# EAGLE design PCB_OnOnfre_SINGLE_rev1 (EAGLE 9.1.3)
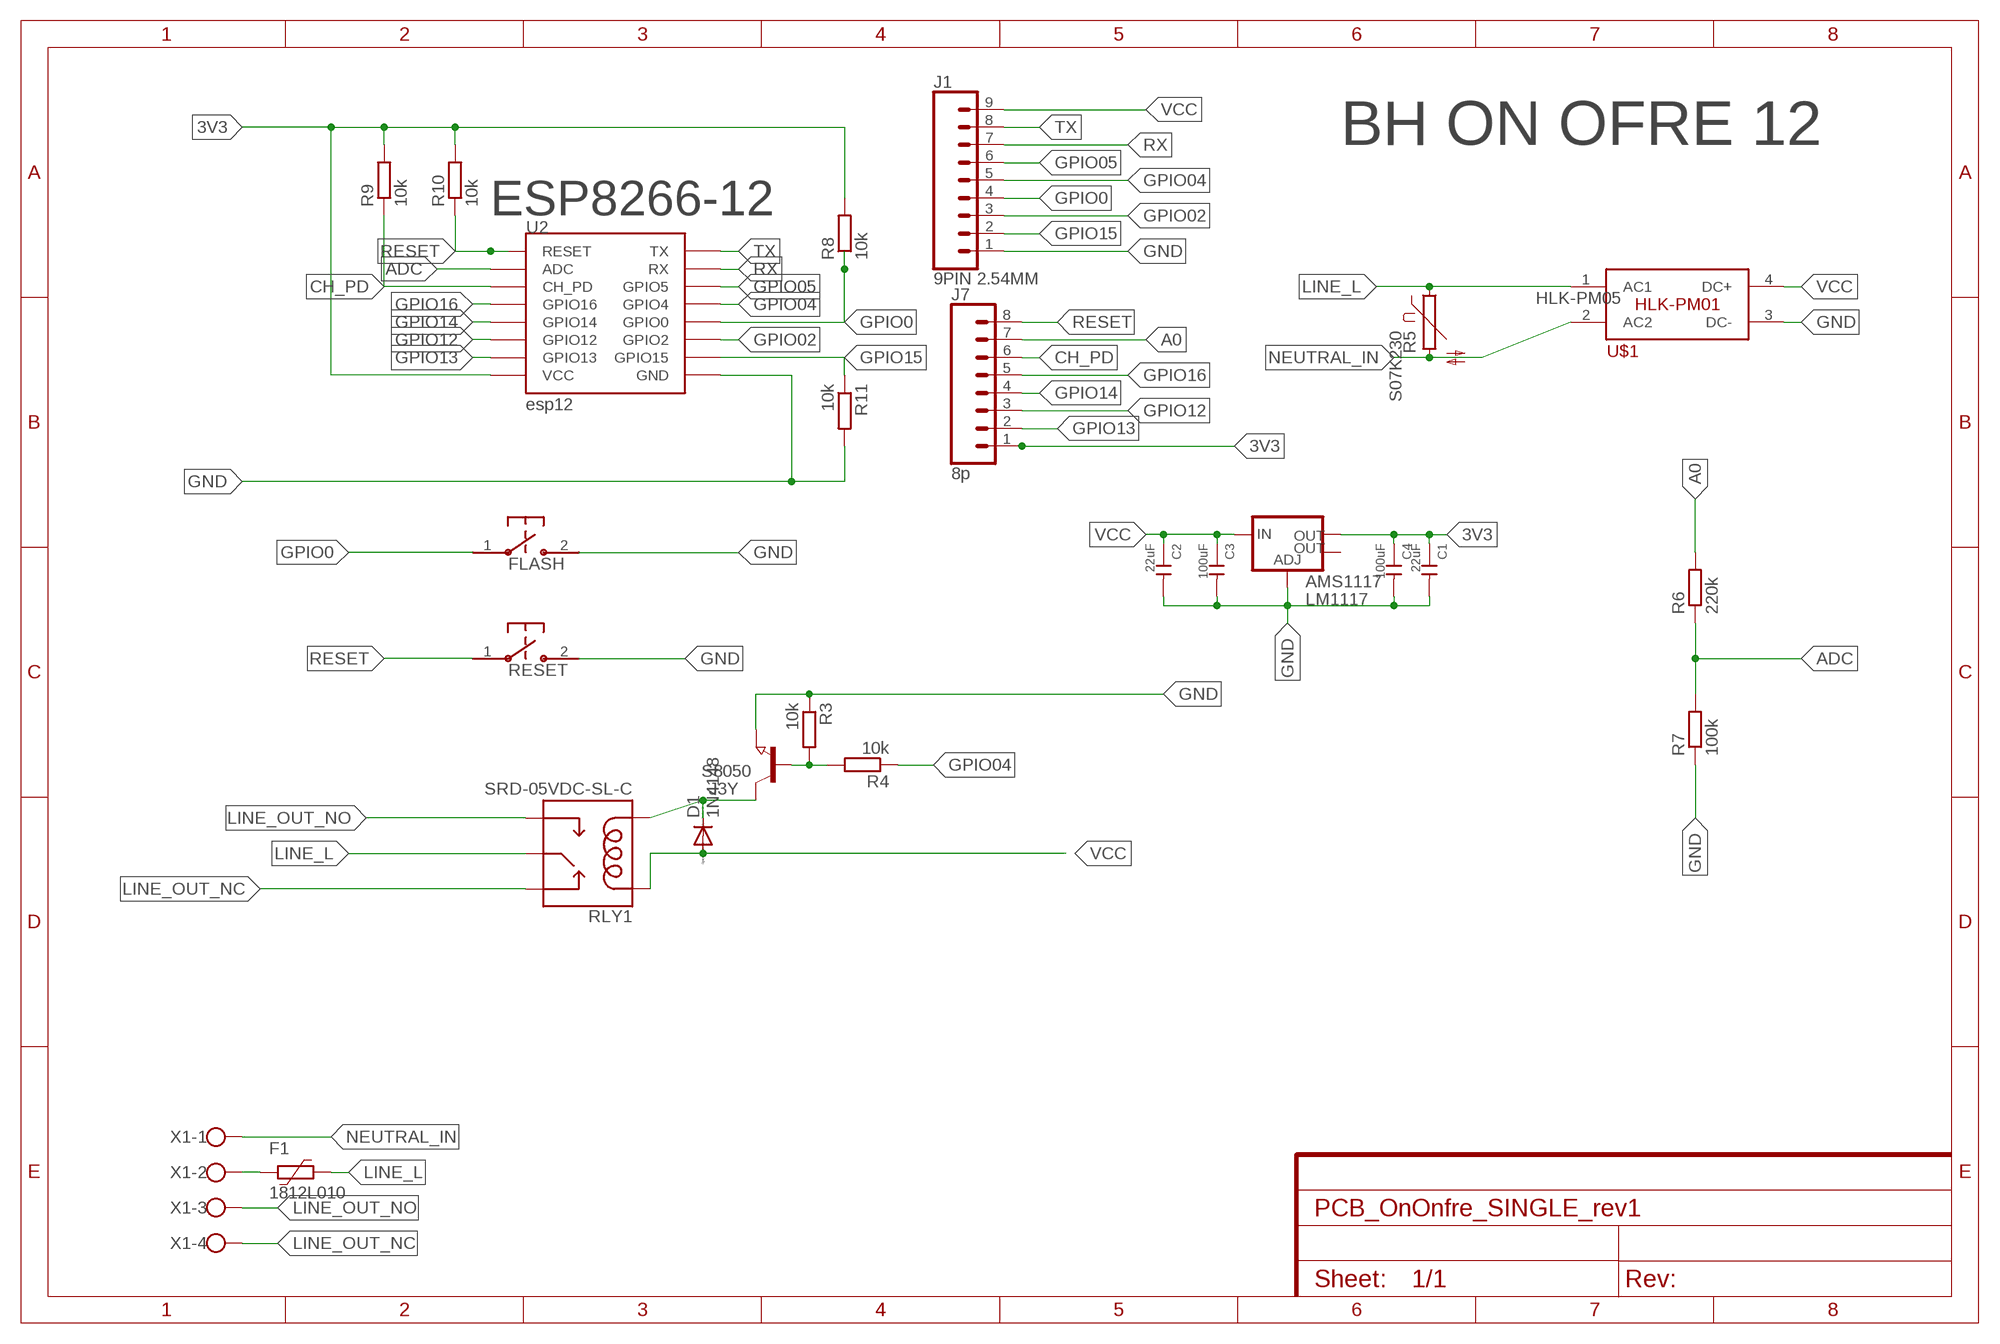
[diagram p0: schematic, sheet 1]

## Parts
AMS1117  LM1117  V_REG_LM1117SOT223  [SOT223]
C1  22uF  CERAMIC-1NF-1KV-10%-X7R(1206)  [C1206]
C2  22uF  CERAMIC-1NF-1KV-10%-X7R(1206)  [C1206]
C3  100uF  CERAMIC-1NF-1KV-10%-X7R(1206)  [C1206]
C4  100uF  CERAMIC-1NF-1KV-10%-X7R(1206)  [C1206]
D1  1N4148  DIODE-SOD80C  [SOD80C]
F1  1812L010  [1812L]
FLASH  B3U-1000P-2P-SMD  B3U-1000P  [B3U-1000P]
J1  9PIN 2.54MM  CONN_09  [1X09]
J3Y  S8050  NPN-TRANSISTOR_SOT23  [SOT23]
J7  8p  CONN_08"  [1X08]
R3  10k  R-EU_R0603  [R0603]
R4  10k  R-EU_R0603  [R0603]
R5  S07K230  [S07K230]
R6  220k  R-EU_R0603  [R0603]
R7  100k  R-EU_R0603  [R0603]
R8  10k  R-EU_R0603  [R0603]
R9  10k  R-EU_R0603  [R0603]
R10  10k  R-EU_R0603  [R0603]
R11  10k  R-EU_R0603  [R0603]
RESET  B3U-1000P-2P-SMD  B3U-1000P  [B3U-1000P]
RLY1  SRD-05VDC-SL-C  RELAYSONGLE  [SRD-5VDC-SL-C]
U2  esp12  ESP12SMD  [ESP12-SMD]
U$1  HLK-PM01  [HLK-PM01]
X1  W237-4  [W237-4]

## Nets
3V3: AMS1117.2(OUT) C1.1 C4.1 J7.1 R8.2 R9.2 R10.2 U2.VCC
A0: J7.7 R6.2
ADC: R6.1 R7.2 U2.ADC
CH_PD: J7.6 R9.1 U2.CH_PD
GND: AMS1117.1(ADJ) C1.2 C2.2 C3.2 C4.2 FLASH.2 J1.1 J3Y.2(E) R3.1 R7.1 R11.2 RESET.2 U2.GND U$1.3(DC-)
GPIO0: FLASH.1 J1.4 R8.1 U2.GPIO0
GPIO02: J1.3 U2.GPIO2
GPIO04: J1.5 R4.1 U2.GPIO4
GPIO05: J1.6 U2.GPIO5
GPIO12: J7.3 U2.GPIO12
GPIO13: J7.2 U2.GPIO13
GPIO14: J7.4 U2.GPIO14
GPIO15: J1.2 R11.1 U2.GPIO15
GPIO16: J7.5 U2.GPIO16
LINE_L [220V]: F1.1 R5.1 RLY1.COMMON(MAIN) U$1.1(AC1)
LINE_OUT_NC: RLY1.CLOSED(NC) X1.4
LINE_OUT_NO [220V]: RLY1.OPEN(NO) X1.3
N$1: D1.C J3Y.3(C) RLY1.COIL2
N$2: F1.2 X1.2
N$7: J3Y.1(B) R3.2 R4.2
NEUTRAL_IN [220V]: R5.2 U$1.2(AC2) X1.1
RESET: J7.8 R10.1 RESET.1 U2.RESET
RX: J1.7 U2.RXD0(RX)
TX: J1.8 U2.TXD0(TX)
VCC: AMS1117.3(IN) C2.1 C3.1 D1.A J1.9 RLY1.COIL1 U$1.4(DC+)
Unconnected: AMS1117.4(OUT)

## Notes on the sheet
- BH ON OFRE 12
- ESP8266-12
- HLK-PM05

## Library data of the parts
AMS1117 = SparkFun-IC-Power:V_REG_LM1117: Voltage Regulator LM1117 Standard adjustable voltage regulator but in SMD form. Spark Fun Electronics SKU : COM-00595; PROD_ID: VREG-08170
C1-C4 = Seeed-Capacitor:CERAMIC-1NF-1KV-10%-X7R?(1206): 302010189; MPN: CC1206KKX7RCBB102; VALUE: 1NF
D1 = diode:DIODE-: DIODE
F1 = polyfuse-smd_10:?: Polyfuse Resettable PTC Source: http://www.littelfuse.com/products/resettable-ptcs.aspx; MF: Littelfuse; MPN: 1812L010; OC_FARNELL: 1822210; OC_NEWARK: 78R5551
FLASH RESET = switches:B3U: Switch; DIGIKEY: SW1020CT-ND; MANUFACTURER: Omron; MPN: B3U-1000P
J1 = SparkFun-Connectors:CONN_09: Multi connection point. Often used as Generic Header-pin footprint for 0.1 inch spaced/style header connections On any of the 0.1 inch spaced packages, you can populate with these: Break Away Headers - Straight <https://www.sparkfun.com/products/116> (PRT-00116) Break Away Male Headers - Right Angle <https://www.sparkfun.com/products/553> (PRT-00553) Female Headers <https://www.sparkfun.com/products/115> (PRT-00115) Break Away Headers - Machine Pin <https://www.sparkfun.com/products/117> (PRT-00117) Break Away Female Headers - Swiss Machine Pin <https://www.sparkfun.com/products/743> (PRT-00743) For SCREWTERMINALS and SPRING TERMINALS visit here: Screw Terimnals on SparkFun.com <https://www.sparkfun.com/search/results?term=Screw+Terminals> (5mm/3.5mm/2.54mm spacing) This device is also useful as a general connection point to wire up your design to another part of your project. Our various solder wires solder well into these plated through hole pads. Hook-Up Wire - Assortment (Stranded, 22 AWG) <https://www.sparkfun.com/products/11375> (PRT-11375) Hook-Up Wire - Assortment (Solid Core, 22 AWG) <https://www.sparkfun.com/products/11367> (PRT-11367) View the entire wire category on our website here <https://www.sparkfun.com/categories/141> Special notes: Molex polarized connector foot print use with SKU : PRT-08231 with associated crimp pins and housings. 1MM SMD Version SKU: PRT-10208 NOTES ON THE VARIANTS LOCK and LOCK_LONGPADS... This footprint was designed to help hold the alignment of a through-hole component (i.e. 6-pin header) while soldering it into place. You may notice that each hole has been shifted either up or down by 0.005 of an inch from it's more standard position (which is a perfectly straight line). This slight alteration caused the pins (the squares in the middle) to touch the edges of the holes. Because they are alternating, it causes a "brace" to hold the component in place. 0.005 has proven to be the perfect amount of "off-center" position when using our standard breakaway headers. Although looks a little odd when you look at the bare footprint, once you have a header in there, the alteration is very hard to notice. Also,if you push a header all the way into place, it is covered up entirely on the bottom side.
J3Y = semicon-smd-ipc:NPN-TRANSISTOR_: NPN TRANSISTOR
J7 = SparkFun-Connectors:CONN_08: Multi connection point. Often used as Generic Header-pin footprint for 0.1 inch spaced/style header connections On any of the 0.1 inch spaced packages, you can populate with these: Break Away Headers - Straight <https://www.sparkfun.com/products/116> (PRT-00116) Break Away Male Headers - Right Angle <https://www.sparkfun.com/products/553> (PRT-00553) Female Headers <https://www.sparkfun.com/products/115> (PRT-00115) Break Away Headers - Machine Pin <https://www.sparkfun.com/products/117> (PRT-00117) Break Away Female Headers - Swiss Machine Pin <https://www.sparkfun.com/products/743> (PRT-00743) Arduino Stackable Header - 8 Pin <https://www.sparkfun.com/products/9279> (PRT-09279) For SCREWTERMINALS and SPRING TERMINALS visit here: Screw Terimnals on SparkFun.com <https://www.sparkfun.com/search/results?term=Screw+Terminals> (5mm/3.5mm/2.54mm spacing) This device is also useful as a general connection point to wire up your design to another part of your project. Our various solder wires solder well into these plated through hole pads. Hook-Up Wire - Assortment (Stranded, 22 AWG) <https://www.sparkfun.com/products/11375> (PRT-11375) Hook-Up Wire - Assortment (Solid Core, 22 AWG) <https://www.sparkfun.com/products/11367> (PRT-11367) View the entire wire category on our website here <https://www.sparkfun.com/categories/141> Special notes: Molex polarized connector foot print use with SKU : PRT-08231 with associated crimp pins and housings. 1MM SMD Version SKU: PRT-10208 NOTES ON THE VARIANTS LOCK and LOCK_LONGPADS... This footprint was designed to help hold the alignment of a through-hole component (i.e. 6-pin header) while soldering it into place. You may notice that each hole has been shifted either up or down by 0.005 of an inch from it's more standard position (which is a perfectly straight line). This slight alteration caused the pins (the squares in the middle) to touch the edges of the holes. Because they are alternating, it causes a "brace" to hold the component in place. 0.005 has proven to be the perfect amount of "off-center" position when using our standard breakaway headers. Although looks a little odd when you look at the bare footprint, once you have a header in there, the alteration is very hard to notice. Also,if you push a header all the way into place, it is covered up entirely on the bottom side.; PROD_ID: CONN-08438
R3 R4 R6-R11 = resistor:R-EU_: RESISTOR, European symbol
R5 = VARISTORESBH:S07K230: VARISTOR
RLY1 = Spark:RELAY: SPDT relay (COM-00101)
U2 = esp8266modules:ESP12: ESP8266 Wifi module 12
U$1 = HLK-PM01:HLK-PM01; AVAILABILITY: Unavailable; MF: Hi-link; MP: hlk-pm01; PACKAGE: Package Analog Devices; PRICE: None
X1 = con-wago-500:W237-4: WAGO SCREW CLAMP; OC_FARNELL: unknown; OC_NEWARK: unknown

## Net classes
1 220V: width 1.27 mm, clearance 2 mm

## Board
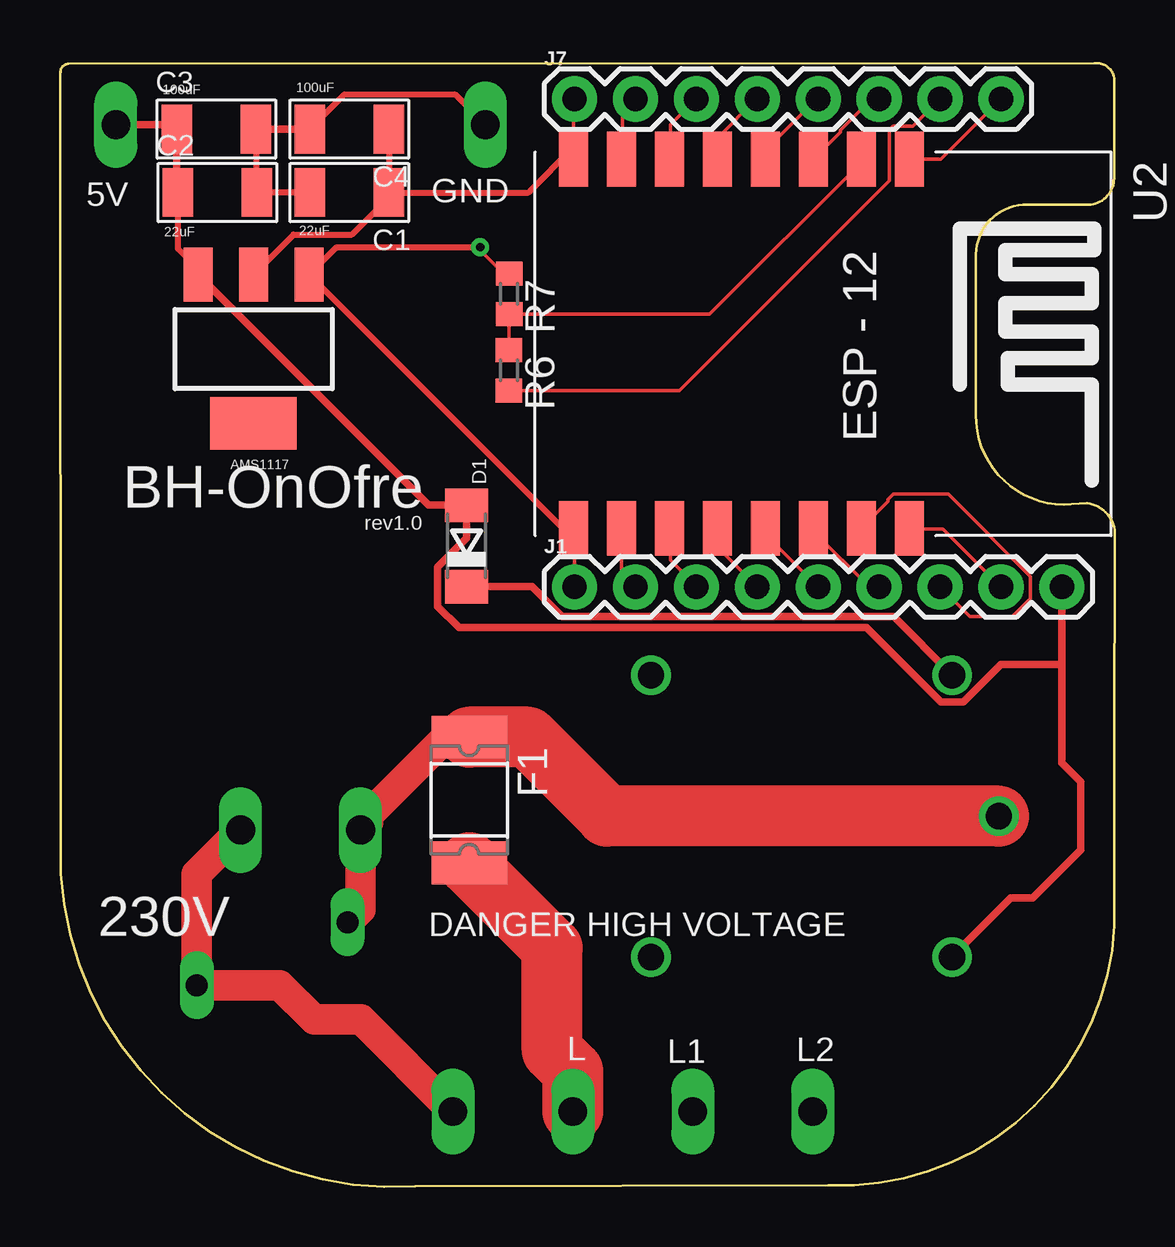
[diagram p1: board, top side]
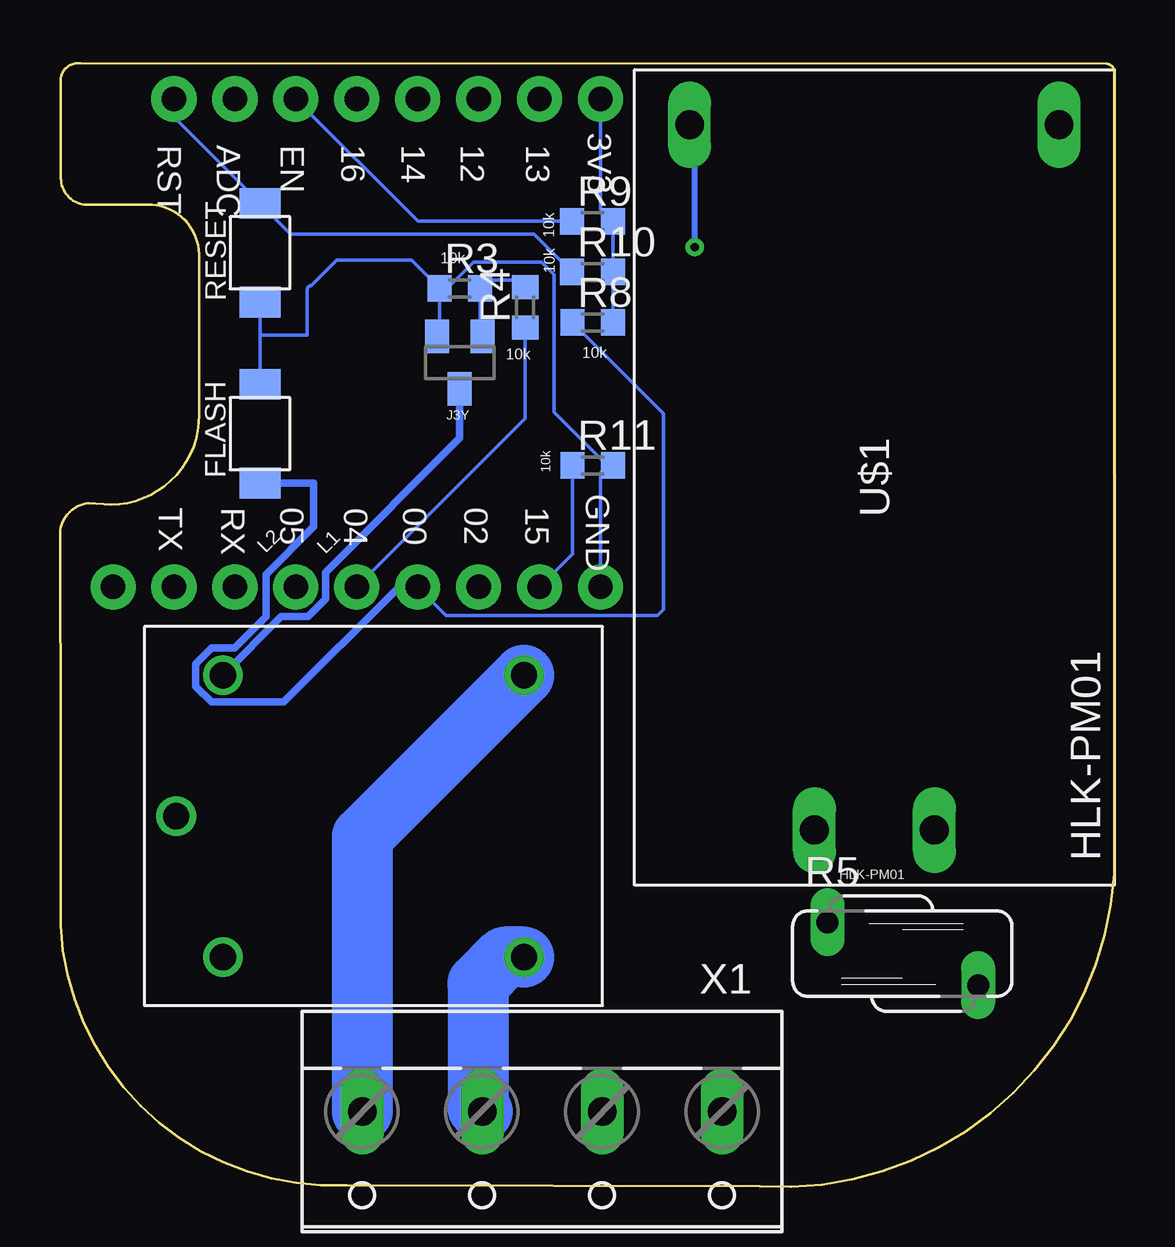
[diagram p2: board, bottom side, seen from below]

Size 43.98 x 46.84 mm. Coordinates in mm from the lower left corner, seen from the top.
Outline: 0.03,46.5 0,46.36
Outline: 0,46.36 0.03,13.06 arc90 14.79,0.02 32.04,0.08 arc90 43.95,10.91 43.94,19.51 43.95,22.33 43.96,22.99 43.97,24.14 43.97,27.01 arc90 42.81,28.5 41.84,28.44 arc-90 38.18,32.19 38.18,38.88 arc-90 40.34,40.95 42.87,40.95 arc90 43.94,42.05 43.94,46.23 arc90 43.11,46.84 0.35,46.82 arc90 0,46.36
Copper layers (1*16): Top 0.035mm / dielectric 1.5mm / Bottom 0.035mm
Design rules "default": minimum track width 6mil, minimum drill 0.35mm, track to track 6mil, track to pad 6mil, pad to pad 6mil, via to via 6mil, smd to smd 6mil, copper to edge 40mil, drill to drill 6mil, minimum pad ring 10mil, minimum via ring 8mil, stop-mask expansion 4mil, vias tented up to drill 0mil, thermal gap 10mil

### Footprints (pad centres in the part's own frame; a part is rotated, then mirrored left to right if it is on the bottom)
SOT223 = smd 1.219 x 2.235: 1 -2.311,-3.099; 2 0,-3.099; 3 2.311,-3.099 | smd 3.6 x 2.2: 4 0,3.099
C1206 = smd 1.27 x 2.032: 1 -1.651,0; 2 1.651,0
SOD80C = smd 1.4 x 1.8: A 1.7,0; C -1.7,0
1812L = smd 1.78 x 3.15: 1 -2.62,0; 2 2.62,0
B3U-1000P = smd 1.283 x 1.7: 1 -2.056,0; 2 2.056,0
1X09 = drill 1.016 pad 1.88: 1 0,0; 2 2.54,0; 3 5.08,0; 4 7.62,0; 5 10.16,0; 6 12.7,0; 7 15.24,0; 8 17.78,0; 9 20.32,0
SOT23 = smd 1 x 1.4: 1 -0.95,-1.1; 2 0.95,-1.1; 3 0,1.1
1X08 = drill 1.016 pad 1.88: 1 0,0; 2 2.54,0; 3 5.08,0; 4 7.62,0; 5 10.16,0; 6 12.7,0; 7 15.24,0; 8 17.78,0
R0603 = smd 1 x 1.1: 1 -0.85,0; 2 0.85,0
S07K230 = drill 0.914 long: 1 -1.311,-3.121; 2 1.311,3.163
SRD-5VDC-SL-C = drill 1.1: CLOSED -6.275,-5.875; COIL1 6.275,5.875; COIL2 6.275,-5.875; COMMON 8.225,0; OPEN -6.275,5.875
ESP12-SMD = smd 2.286 x 1.2: ADC -7.792,3.8; CH_PD -7.792,1.8; GND 7.592,-8.2; GPIO0 7.592,-2.2; GPIO2 7.592,-4.2; GPIO4 7.592,-0.2; GPIO5 7.592,1.8; GPIO12 -7.792,-4.2; GPIO13 -7.792,-6.2; GPIO14 -7.792,-2.2; GPIO15 7.592,-6.2; GPIO16 -7.792,-0.2; RESET -7.792,5.8; RXD0 7.592,3.8; TXD0 7.592,5.8; VCC -7.792,-8.2
HLK-PM01 = drill 1.2 long: 1 -14.7,2.5; 2 -14.7,-2.5; 3 14.7,7.7; 4 14.7,-7.7
W237-4 = drill 1.194 long: 1 -7.5,-1.27; 2 -2.5,-1.27; 3 2.5,-1.27; 4 7.5,-1.27

### Placement (x,y rotation side)
AMS1117  8.07,34.93 180 top
C1  12.06,41.45 180 top
C2  6.57,41.45 0 top
C3  6.52,44.1 0 top
C4  12.06,44.1 180 top
D1  16.95,26.72 90 top
F1  17.06,16.13 270 top
FLASH  35.64,31.4 90 bottom
J1  21.45,25.01 0 top
J3Y  27.32,34.36 180 bottom
J7  21.45,45.35 0 top
R3  27.31,37.45 0 bottom
R4  24.59,36.67 90 bottom
R5  8.86,9.72 270 bottom
R6  18.71,34.04 270 top
R7  18.72,37.23 270 top
R8  21.77,36.03 0 bottom
R9  21.78,40.25 0 bottom
R10  21.78,38.14 0 bottom
R11  21.77,30.08 0 bottom
RESET  35.64,38.94 270 bottom
RLY1  30.91,15.46 180 bottom
U2  29.61,35.05 270 top
U$1  10.03,29.58 90 bottom
X1  23.88,1.87 180 bottom

### Tracks (layer width: path | path; a pad name or v marks a point on that pad's centre or on a via)
3V3
  Top 0.152: U2.VCC 21.41,43.33 21.41,45.31 J7.1 | 13.7,42.05 13.7,41.59 C1.1 13.71,41.62 13.7,42.05
  Top 0.254: C4.1 13.72,41.63 13.71,41.62 | C1.1 13.93,41.45 | 13.93,41.45 19.53,41.45 21.41,43.33 | AMS1117.2 9.74,39.7 12.17,39.7 13.93,41.45
  Bottom 0.152: R8.2 R10.2 20.93,40.24 | 20.93,40.24 R9.2 | R9.2 | J7.1 21.45,40.76 20.93,40.24
A0
  Top 0.152: J7.7 35.55,44.21 34.71,44.21 34.58,44.08 34.58,41.94 25.83,33.19 R6.2
ADC
  Top 0.152: U2.ADC 33.41,42.71 27.08,36.38 R7.2 R6.1
CH_PD
  Top 0.152: U2.CH_PD 31.46,42.9 32.52,43.97 32.52,44.04 33.82,45.34 34.12,45.34 J7.6
  Bottom 0.152: R9.1 29.05,40.26 J7.6
GND  (via drill 0.35)
  Top 0.152: U2.GND arc-90 21.45,27.42 21.45,26.61 J1.1 | R7.1 18.49,38.08 17.39,39.17
  Top 0.254: C4.2 11.86,45.54 16.36,45.55 16.46,45.55 U$1.3 | C3.2 8.17,41.5 C2.2 C1.2 | v17.52,39.17 17.39,39.17 11.53,39.17 AMS1117.1 21.45,26.96 21.45,26.61
  Top 0.305: C3.2 C4.2
  Bottom 0.152: RESET.2 35.64,35.51 | 35.64,35.51 FLASH.2 | J1.1 21.45,29.64 arc90 R11.2 21.17,30.1 23.38,32.31 23.38,38.02 23.91,38.56 26.73,38.56 27.8,37.49 28.11,37.49 R3.1 | R3.1 28.16,35.56 J3Y.2 | R3.1 28.18,37.49 29.32,38.63 32.45,38.63 33.52,37.57 arc-90 33.67,37.41 33.67,35.51 35.64,35.51
  Bottom 0.254: v17.52,39.17 17.52,44.06 U$1.3
GPIO0
  Top 0.152: U2.GPIO0 27.41,26.67 J1.4
  Bottom 0.152: R8.1 18.83,32.24 18.83,24.07 19.07,23.83 27.88,23.83 28.97,24.91 J1.4
  Bottom 0.305: 35.39,29.1 FLASH.1 33.4,29.34 33.4,27.52 35.39,25.53 35.39,23.78 36.7,22.47 37.65,22.47 38.31,21.81 38.31,20.87 37.65,20.21 34.65,20.21 29.95,24.91 28.97,24.91
GPIO02
  Top 0.152: U2.GPIO2 25.44,27.43 25.44,26.14 26.5,25.07 J1.3
GPIO04
  Top 0.152: U2.GPIO4 29.48,27.43 29.48,27.13 31.53,25.07 J1.5
  Bottom 0.152: R4.1 24.59,32.03 J1.5
GPIO05
  Top 0.152: U2.GPIO5 31.46,27.43 31.46,27.28 33.67,25.07 34.12,25.07 J1.6
GPIO12
  Top 0.152: U2.GPIO12 25.44,42.9 25.44,44.27 26.5,45.34 J7.3
GPIO13
  Top 0.152: U2.GPIO13 23.46,42.9 23.46,44.88 23.91,45.34 J7.2
GPIO14
  Top 0.152: U2.GPIO14 27.42,42.9 27.42,43.74 29.02,45.34 J7.4
GPIO15
  Top 0.152: U2.GPIO15 23.41,25.59 J1.2
  Bottom 0.152: R11.1 22.62,26.38 J1.2
GPIO16
  Top 0.152: U2.GPIO16 29.48,42.9 29.48,43.28 31.53,45.34 J7.5
LINE_L
  Top 1.27: R5.1 12.53,11.58 U$1.1 12.85,15.2 12.85,15.49 16.11,18.75 F1.1
  Top 2.54: F1.1 19.51,18.75 22.79,15.46 RLY1.COMMON
LINE_OUT_NC
  Bottom 2.54: X1.4 31.38,14.59 RLY1.CLOSED
LINE_OUT_NO
  Bottom 2.54: RLY1.OPEN 25.44,9.59 26.56,8.48 26.56,3.32 X1.3
N$1
  Top 0.305: RLY1.COIL2 34.75,23.77 20.93,23.77 19.68,25.02 D1.C
  Bottom 0.305: J3Y.3 27.32,31.21 32.9,25.62 32.9,24.5 33.63,23.77 34.75,23.77 RLY1.COIL2
N$2
  Top 2.54: F1.2 17.06,13.42 20.51,9.97 20.51,5.69 21.38,4.83 X1.2
N$7
  Bottom 0.152: J3Y.1 26.46,35.56 R3.2 26.43,37.49 26.12,37.79 24.6,37.79 R4.2
NEUTRAL_IN
  Top 1.27: U$1.2 5.7,13.05 R5.2 9.16,8.41 10.6,6.98 12.54,6.98 X1.1
RESET
  Top 0.152: U2.RESET 36.71,42.84 J7.8
  Bottom 0.152: R10.1 24.21,39.72 34.36,39.72 RESET.1 39.23,44.59 J7.8
RX
  Top 0.152: U2.RXD0 33.44,27.51 34.51,28.57 34.51,28.65 34.73,28.88 37.02,28.88 40.45,25.45 40.45,24.53 39.69,23.77 37.93,23.77 36.72,24.99 J1.7
TX
  Top 0.152: U2.TXD0 35.42,27.43 36.79,27.43 39.15,25.07 J1.8
VCC
  Top 0.152: 5.71,38.31 AMS1117.3 | C3.1 4.86,44.41 C3.1
  Top 0.254: C2.1 4.91,39.11 5.71,38.31
  Top 0.305: U$1.4 4.57,44.28 C3.1 4.87,41.5 C2.1 | RLY1.COIL1 39.64,12.04 40.55,12.04 42.56,14.05 42.56,16.88 41.77,17.67 41.77,21.78 | 41.77,21.78 J1.9 | AMS1117.3 15.36,28.42 D1.A 16.95,27.05 15.74,25.85 15.74,24.2 16.63,23.31 33.61,23.31 36.72,20.21 37.65,20.21 39.23,21.78 41.77,21.78

### Text on the board
tNames: 5V | GND | BH-OnOfre | rev1.0 | 230V | DANGER HIGH VOLTAGE | L1 | L | L2
bNames: 3V3 | 13 | 12 | 14 | 16 | EN | ADC | RST | GND | 15 | 02 | 00 | 04 | 05 | RX | TX | L1 | L2 | HLK-PM01